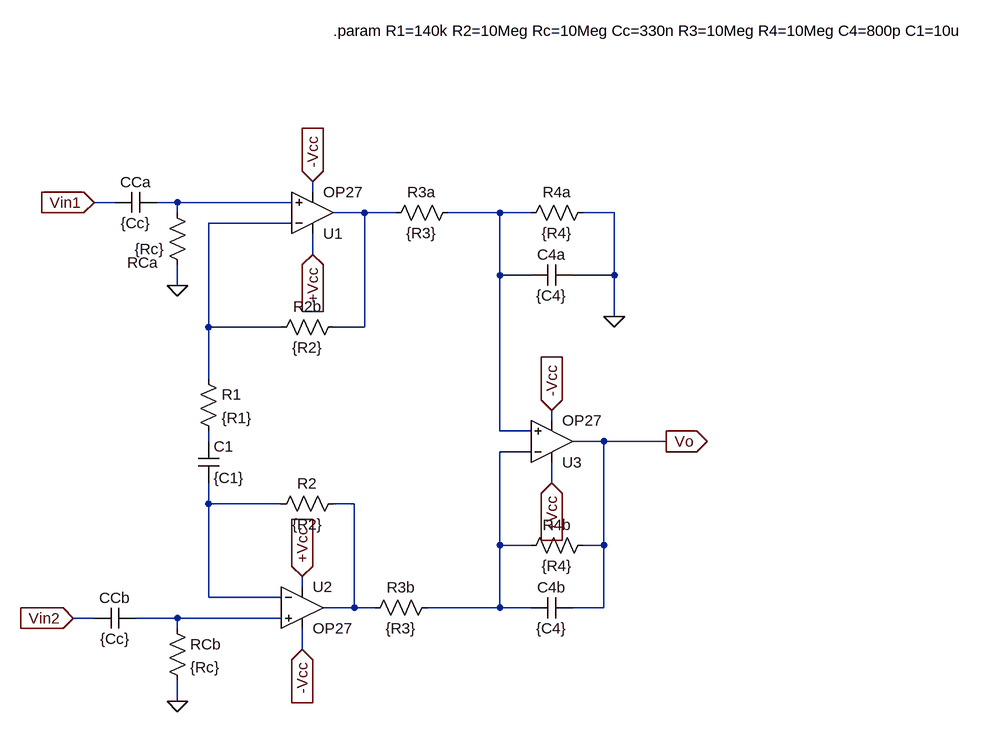
[diagram p0: schematic Lab.asc]
Lab.asc, the LTspice schematic file:
Version 4.1
SHEET 1 1348 680
WIRE 256 -288 256 -304
WIRE -48 -272 -80 -272
WIRE 48 -272 16 -272
WIRE 224 -272 48 -272
WIRE 48 -256 48 -272
WIRE 336 -256 288 -256
WIRE 384 -256 336 -256
WIRE 544 -256 464 -256
WIRE 592 -256 544 -256
WIRE 720 -256 672 -256
WIRE 224 -240 96 -240
WIRE 256 -192 256 -224
WIRE 544 -160 544 -256
WIRE 592 -160 544 -160
WIRE 720 -160 720 -256
WIRE 720 -160 656 -160
WIRE 48 -144 48 -176
WIRE 720 -96 720 -160
WIRE 96 -80 96 -240
WIRE 208 -80 96 -80
WIRE 336 -80 336 -256
WIRE 336 -80 288 -80
WIRE 96 0 96 -80
WIRE 624 64 624 48
WIRE 544 80 544 -160
WIRE 592 80 544 80
WIRE 96 96 96 80
WIRE 704 96 656 96
WIRE 800 96 704 96
WIRE 592 112 544 112
WIRE 624 160 624 128
WIRE 96 192 96 160
WIRE 208 192 96 192
WIRE 320 192 288 192
WIRE 544 256 544 112
WIRE 592 256 544 256
WIRE 704 256 704 96
WIRE 704 256 672 256
WIRE 240 320 240 304
WIRE 96 336 96 192
WIRE 208 336 96 336
WIRE 320 352 320 192
WIRE 320 352 272 352
WIRE 352 352 320 352
WIRE 544 352 544 256
WIRE 544 352 432 352
WIRE 592 352 544 352
WIRE 704 352 704 256
WIRE 704 352 656 352
WIRE -80 368 -112 368
WIRE 48 368 -16 368
WIRE 208 368 48 368
WIRE 48 384 48 368
WIRE 240 416 240 384
WIRE 48 496 48 464
FLAG 48 -144 0
FLAG 48 496 0
FLAG 720 -96 0
FLAG -80 -272 Vin1
IOPIN -80 -272 In
FLAG -112 368 Vin2
IOPIN -112 368 In
FLAG 800 96 Vo
IOPIN 800 96 Out
FLAG 256 -304 -Vcc
IOPIN 256 -304 In
FLAG 240 416 -Vcc
IOPIN 240 416 In
FLAG 624 48 -Vcc
IOPIN 624 48 In
FLAG 256 -192 +Vcc
IOPIN 256 -192 In
FLAG 240 304 +Vcc
IOPIN 240 304 In
FLAG 624 160 +Vcc
IOPIN 624 160 In
SYMBOL lib\\lib\\sym\\ZZZ\\OpAmps\\OP27 256 -192 M180
SYMATTR InstName U1
SYMBOL lib\\lib\\sym\\ZZZ\\OpAmps\\OP27 240 288 R0
SYMATTR InstName U2
SYMBOL lib\\lib\\sym\\ZZZ\\OpAmps\\OP27 624 160 M180
SYMATTR InstName U3
SYMBOL res 80 -16 R0
SYMATTR InstName R1
SYMATTR Value {R1}
SYMATTR SpiceLine tol=1
SYMBOL cap 80 96 R0
SYMATTR InstName C1
SYMATTR Value {C1}
SYMBOL res 304 176 R90
WINDOW 0 0 56 VBottom 2
WINDOW 3 32 56 VTop 2
SYMATTR InstName R2
SYMATTR Value {R2}
SYMBOL res 448 336 R90
WINDOW 0 0 56 VBottom 2
WINDOW 3 32 56 VTop 2
SYMATTR InstName R3b
SYMATTR Value {R3}
SYMATTR SpiceLine tol=1
SYMBOL res 480 -272 R90
WINDOW 0 0 56 VBottom 2
WINDOW 3 32 56 VTop 2
SYMATTR InstName R3a
SYMATTR Value {R3}
SYMATTR SpiceLine tol=1
SYMBOL res 304 -96 R90
WINDOW 0 0 56 VBottom 2
WINDOW 3 32 56 VTop 2
SYMATTR InstName R2b
SYMATTR Value {R2}
SYMATTR SpiceLine tol=1
SYMBOL res 64 -160 R180
WINDOW 0 45 19 Left 2
WINDOW 3 36 40 Left 2
SYMATTR InstName RCa
SYMATTR Value {Rc}
SYMBOL cap 16 -288 R90
WINDOW 0 0 32 VBottom 2
WINDOW 3 32 32 VTop 2
SYMATTR InstName CCa
SYMATTR Value {Cc}
SYMBOL cap -16 352 R90
WINDOW 0 0 32 VBottom 2
WINDOW 3 32 32 VTop 2
SYMATTR InstName CCb
SYMATTR Value {Cc}
SYMBOL res 32 368 R0
SYMATTR InstName RCb
SYMATTR Value {Rc}
SYMBOL res 688 240 R90
WINDOW 0 0 56 VBottom 2
WINDOW 3 32 56 VTop 2
SYMATTR InstName R4b
SYMATTR Value {R4}
SYMATTR SpiceLine tol=1
SYMBOL cap 656 336 R90
WINDOW 0 0 32 VBottom 2
WINDOW 3 32 32 VTop 2
SYMATTR InstName C4b
SYMATTR Value {C4}
SYMBOL res 688 -272 R90
WINDOW 0 0 56 VBottom 2
WINDOW 3 32 56 VTop 2
SYMATTR InstName R4a
SYMATTR Value {R4}
SYMATTR SpiceLine tol=1
SYMBOL cap 656 -176 R90
WINDOW 0 0 32 VBottom 2
WINDOW 3 32 32 VTop 2
SYMATTR InstName C4a
SYMATTR Value {C4}
TEXT 288 -536 Left 2 !.param R1=140k R2=10Meg Rc=10Meg Cc=330n R3=10Meg R4=10Meg C4=800p C1=10u

The netlist it stands for:
* Lab.asc
X§U1 N001 N004 +Vcc -Vcc N002 OP27  ; pins In+ In- V+ V- OUT
X§U2 N009 N007 +Vcc -Vcc N008 OP27  ; pins In+ In- V+ V- OUT
X§U3 N003 N006 +Vcc -Vcc Vo OP27  ; pins In+ In- V+ V- OUT
R1 N004 N005 {R1} tol=1
C1 N005 N007 {C1}
R2 N008 N007 {R2}
R3b N006 N008 {R3} tol=1
R3a N003 N002 {R3} tol=1
R2b N002 N004 {R2} tol=1
RCa 0 N001 {Rc}
CCa N001 Vin1 {Cc}
CCb N009 Vin2 {Cc}
RCb N009 0 {Rc}
R4b Vo N006 {R4} tol=1
C4b Vo N006 {C4}
R4a 0 N003 {R4} tol=1
C4a 0 N003 {C4}
.param R1=140k R2=10Meg Rc=10Meg Cc=330n R3=10Meg R4=10Meg C4=800p C1=10u
.lib ADI.lib
.backanno
.end